# Altium schematic sheet Lithium Battery UVP Switch.SchDoc
size A4; Organization: TESLA Motors, INC; Address1: 3500 Deer Creek Road; Address2: Palo Alto, CA; Address4: U.S.A.; SheetNumber: 7; SheetTotal: 21
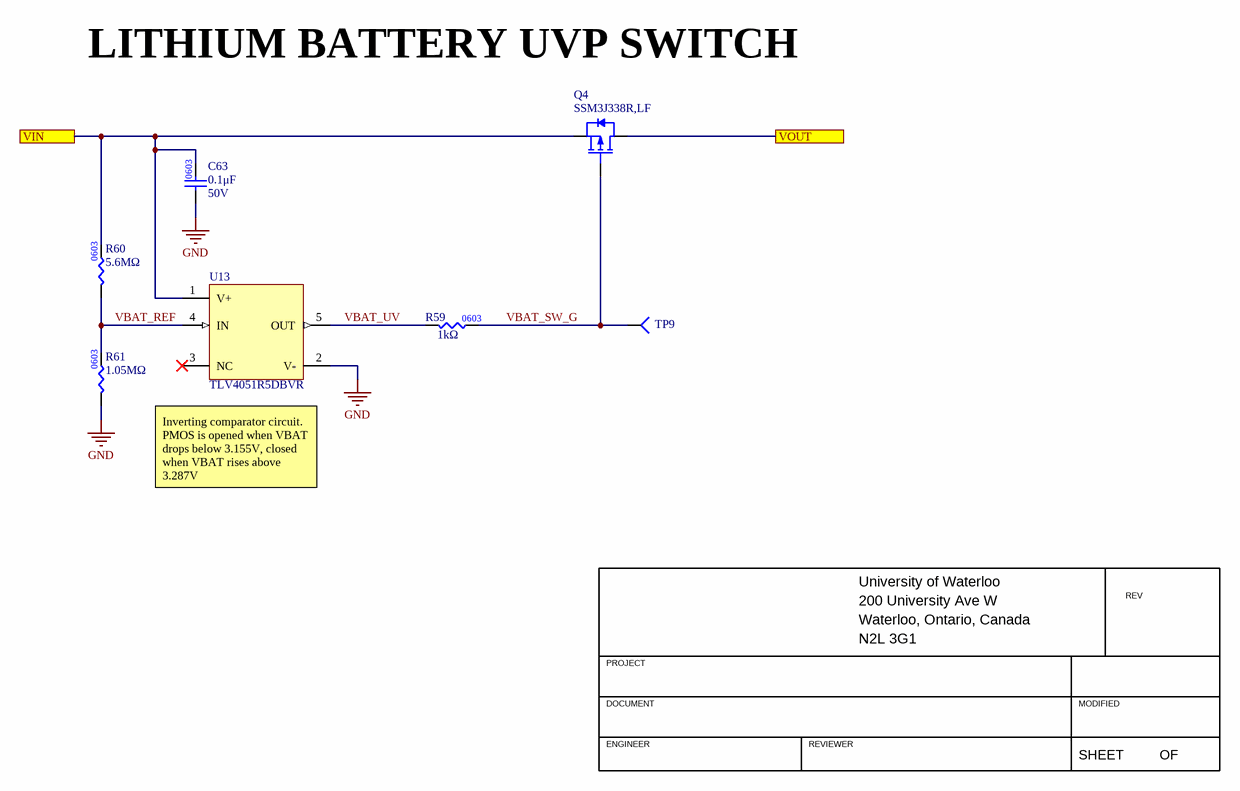
[diagram p0: Lithium Battery UVP Switch.SchDoc]

## Parts
C63  value 0.1μF  Voltage Rating: 50V  [CAP0603]  (hidden comment: CAP_0.1uF_50V_0603)
Q4  Manufacturer Part Number 1: SSM3J338R,LF  [DIO-INC_SOT23]  (hidden comment: PMOS_12V_6A)
R59  value 1kΩ  [RES0603]  (hidden comment: RES_1kΩ_0603_1%)
R60  value 5.6MΩ  [RES0603]  (hidden comment: RES_5.6MΩ_0603_1%)
R61  value 1.05MΩ  [RES0603]  (hidden comment: RES_1.05MΩ_0603_1%)
TP9  TESTPOINT_1MM_CIRCLE  [TESTPOINT_CIRCLE_1MM]  (value not drawn)  (no BOM)
U13  TLV4051R5DBVR  [TI_SOT23-5]

## Ports
VIN, VOUT

## Nets
GND: C63.1 R61.1 U13.2(V-)
VBAT_REF: R60.1 R61.2 U13.4(IN)
VBAT_SW_G: Q4.1(Gate) R59.2 TP9.1(=value)
VBAT_UV: R59.1 U13.5(OUT)
VIN: C63.2 Q4.2(Source) R60.2 U13.1(V+) ; port VIN
VOUT: Q4.3(Drain) ; port VOUT

Not connected (* = marked no-connect by the designer): U13 3(NC)*

## Notes on the sheet
- LITHIUM BATTERY UVP SWITCH
- Inverting comparator circuit. PMOS is opened when VBAT drops below 3.155V, closed when VBAT rises above 3.287V
- University of Waterloo
- 200 University Ave W
- REV
- PROJECT
- Waterloo, Ontario, Canada
- N2L 3G1
- DOCUMENT
- ENGINEER
- REVIEWER
- MODIFIED
- SHEET
- OF

## Library data of the parts
C63 = CAP_0.1uF_50V_0603: CAP CER 0.1UF 50V X7R 0603; Manufacturer Part Number 1: CC0603KRX7R9BB104; Manufacturer 1: Yageo; Package/Footprint: 0603; Supplier Part Number 1: 311-1344-1-ND; Supplier 1: Digi-Key; Mounting Type: SMD; Dielectric: X7R
Q4 = PMOS_12V_6A: MOSFET P-CH 12V 6A SOT23F; Manufacturer 1: Toshiba Semiconductor and Storage; Supplier 1: Digi-Key; Supplier Part Number 1: SSM3J338RLFCT-ND
R59 = RES_1kΩ_0603_1%: RES 1K OHM 1% 1/8W 0603; Manufacturer 1: Stackpole Electronics Inc; Manufacturer Part Number 1: RNCP0603FTD1K00; Supplier Part Number 1: RNCP0603FTD1K00CT-ND; Supplier 1: Digi-Key; Mounting Type: SMD; Package: 0603
R60 = RES_5.6MΩ_0603_1%: RES SMD 5.6M OHM 1% 1/10W 0603; Manufacturer 1: Vishay Dale; Manufacturer Part Number 1: CRCW06035M60FKEA; Supplier 1: Digi-Key; Supplier Part Number 1: 541-5.60MHCT-ND; Tolerance: 1%; Package: 0603
R61 = RES_1.05MΩ_0603_1%: RES SMD 1.05M OHM 1% 1/10W 0603; Manufacturer 1: Stackpole Electronics Inc; Manufacturer Part Number 1: RMCF0603FT1M05; Supplier Part Number 1: RMCF0603FT1M05CT-ND; Supplier 1: Digi-Key; Mounting Type: SMD; Package: 0603
TP9 = TESTPOINT_1MM_CIRCLE: TESTPOINT 1MM CIRCLE
U13 = TLV4051R5DBVR: IC COMPARATOR 1 VOL REF SOT23-5; Manufacturer 1: Texas Instruments; Supplier 1: Digi-Key; Supplier Part Number 1: 296-TLV4051R5DBVRCT-ND; Manufacturer Part Number 1: TLV4051R5DBVR